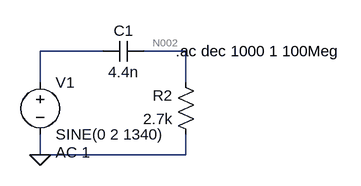
[diagram p0: schematic Rc_passo_alto.asc]
Rc_passo_alto.asc, the LTspice schematic file:
Version 4.1
SHEET 1 880 680
WIRE 224 -32 128 -32
WIRE 352 -32 288 -32
WIRE 128 16 128 -32
WIRE 352 16 352 -32
WIRE 128 128 128 96
WIRE 352 128 352 96
WIRE 352 128 128 128
FLAG 128 128 0
SYMBOL voltage 128 0 R0
WINDOW 123 24 124 Left 2
WINDOW 39 0 0 Left 0
SYMATTR Value2 AC 1
SYMATTR InstName V1
SYMATTR Value SINE(0 2 1340)
SYMBOL res 368 112 R180
WINDOW 0 36 76 Left 2
WINDOW 3 36 40 Left 2
SYMATTR InstName R2
SYMATTR Value 2.7k
SYMBOL cap 288 -48 R90
WINDOW 0 0 32 VBottom 2
WINDOW 3 32 32 VTop 2
SYMATTR InstName C1
SYMATTR Value 4.4n
TEXT 336 -32 Left 2 !.ac dec 1000 1 100Meg

The netlist it stands for:
* Rc_passo_alto.asc
V1 N001 0 SINE(0 2 1340) AC 1
R2 0 N002 2.7k
C1 N002 N001 4.4n
.ac dec 1000 1 100Meg
.backanno
.end

* Results of the author's LTspice run, read from the files saved beside the schematic
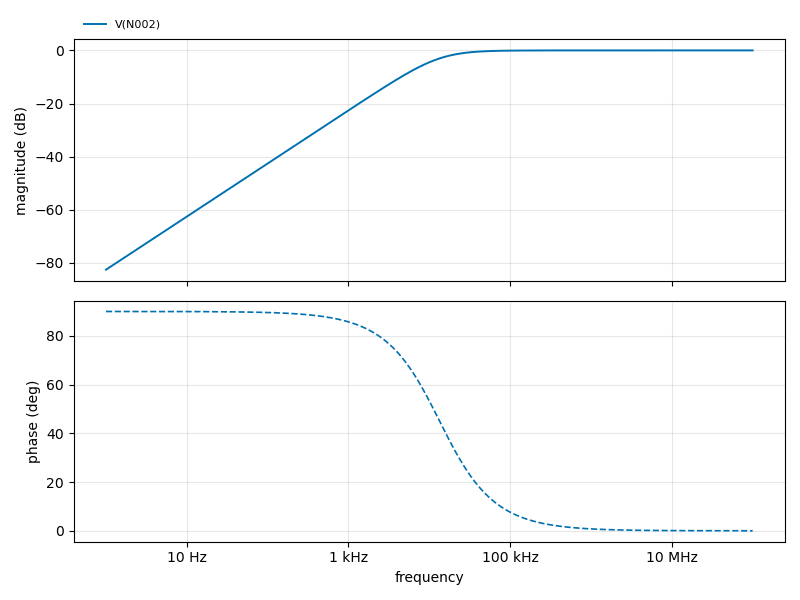
[diagram p1: AC Analysis of Rc_passo_alto.asc, plotted from the saved traces]
* AC Analysis, 1 run:
*   V(N002): -82.54 dB at 1 Hz, -0.00 dB at 100 MHz, peak -0.00 dB at 100 MHz, 3 dB below the peak at 13.4 kHz